# Altium project EDA-02267-V6-0_project.PrjPCB (part 1 of 3)
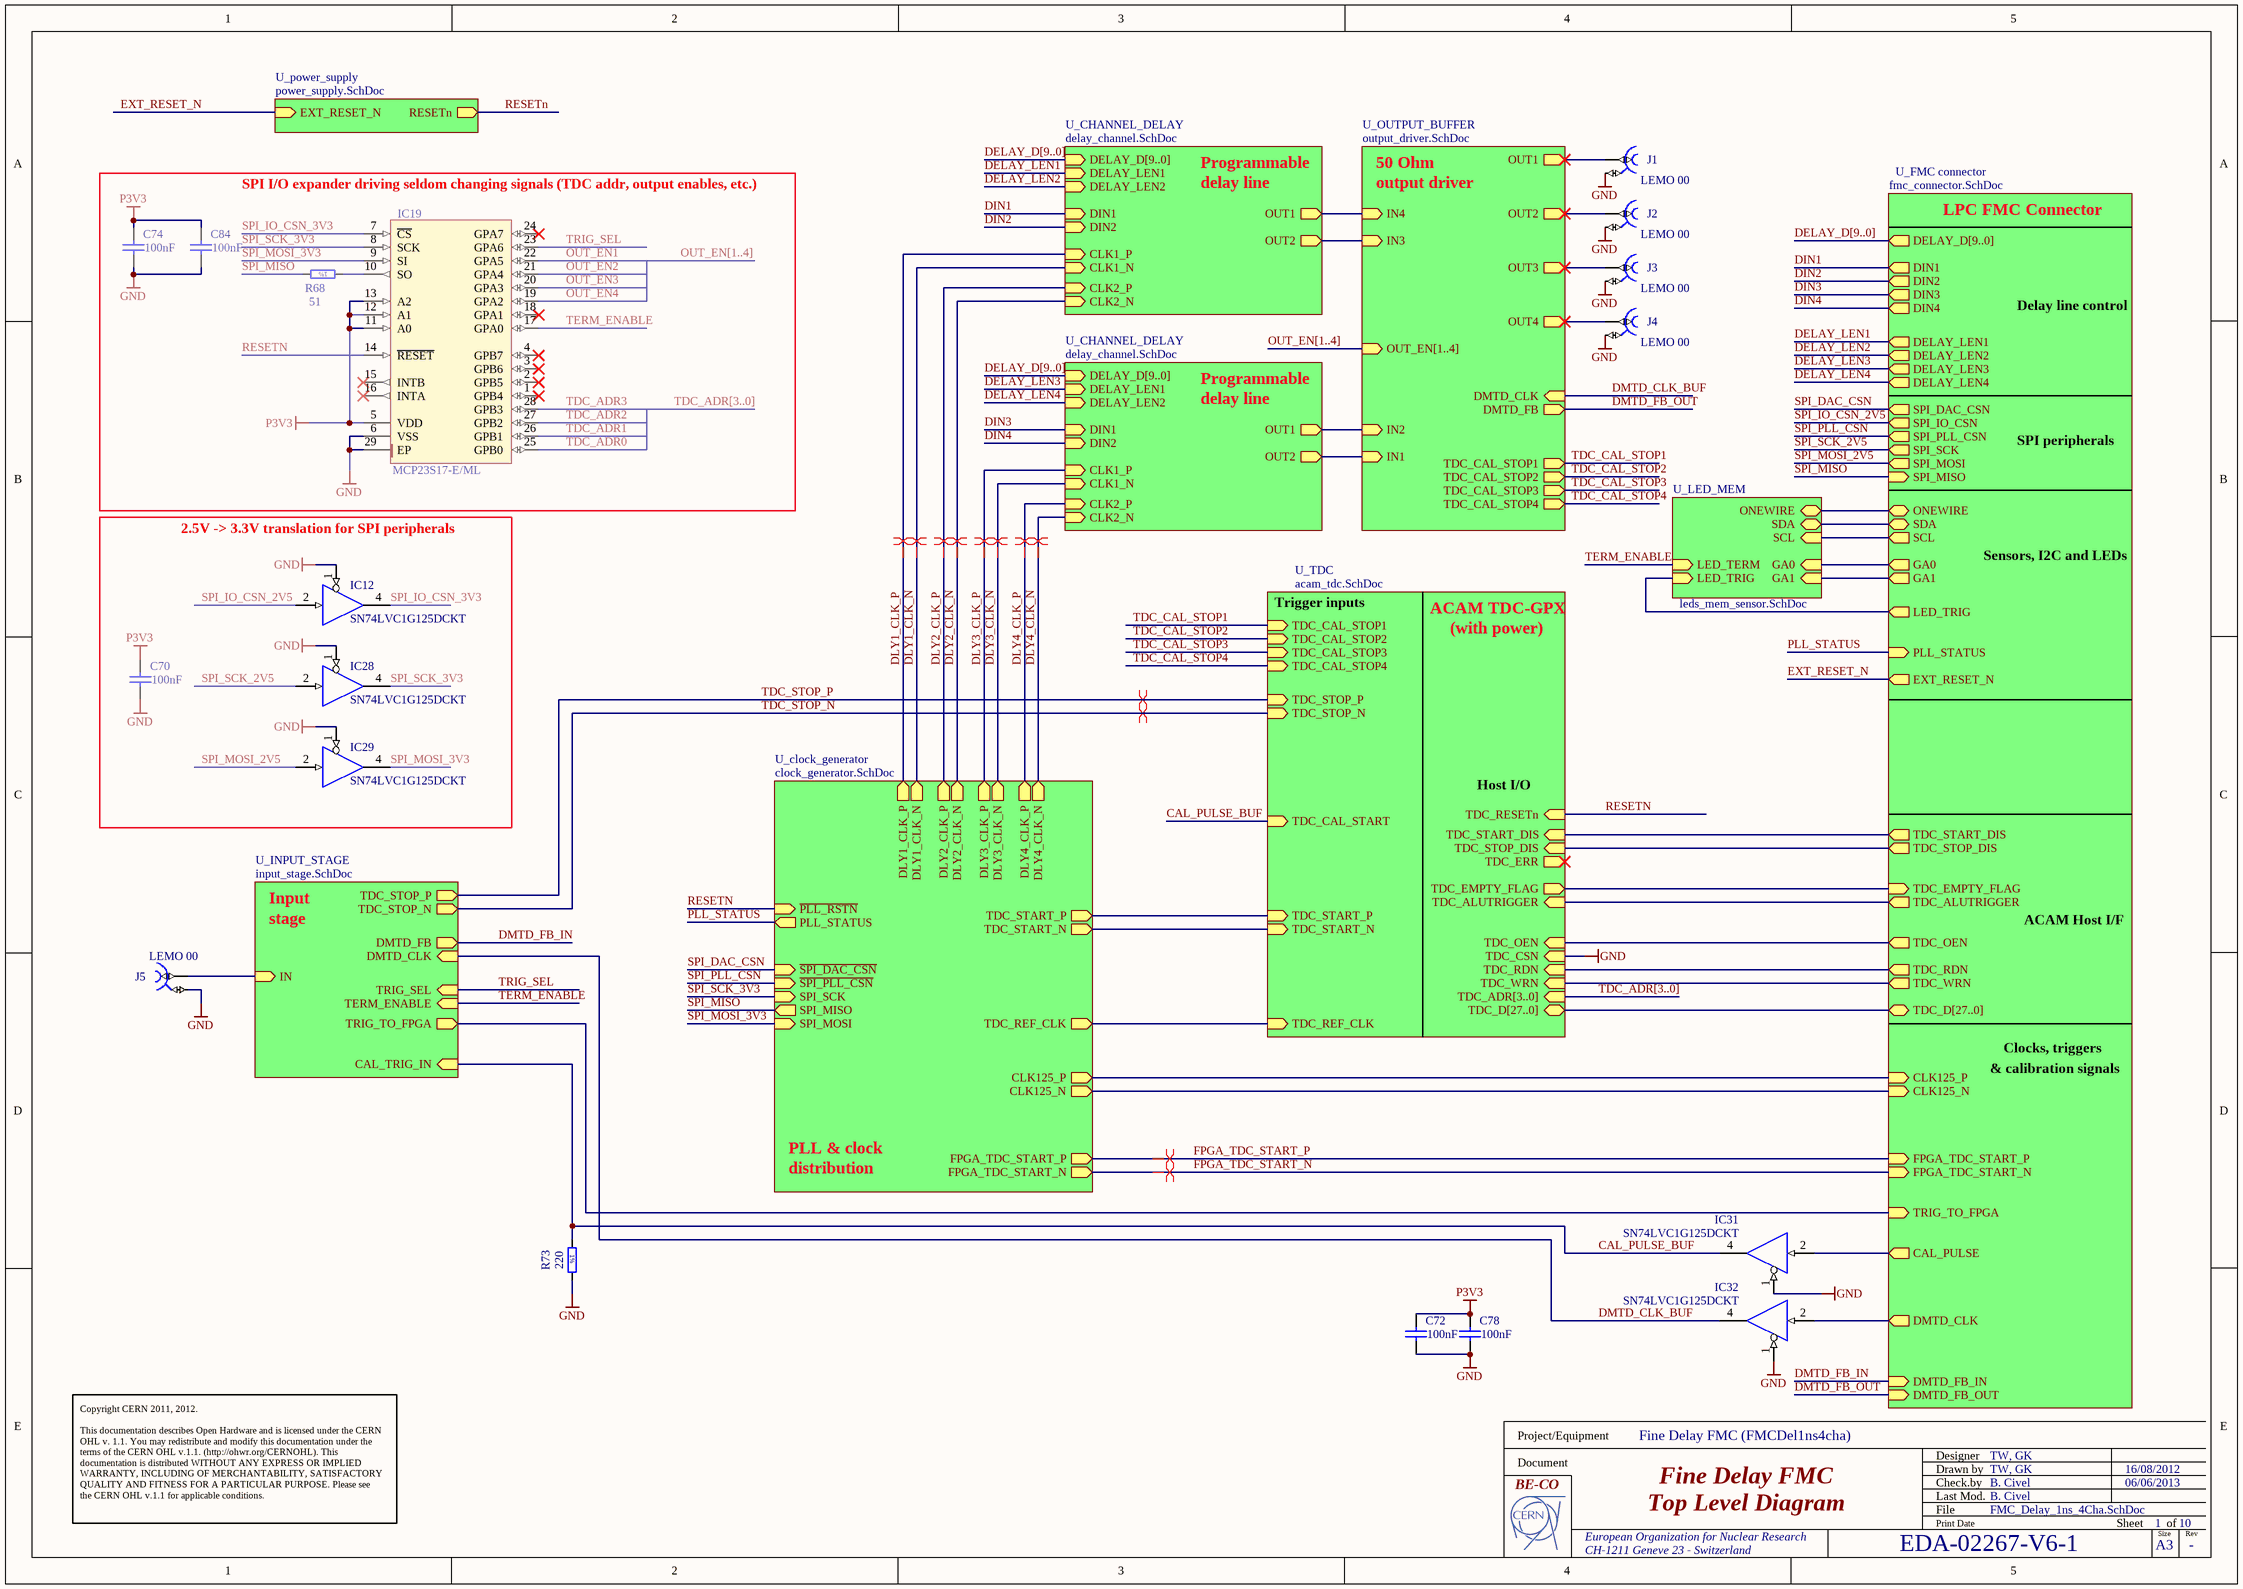
[diagram p0: FMC_Delay_1ns_4Cha.SchDoc]
10 sheets, 354 parts. Net scope: hierarchical (ports join the sheet entries above them; power ports are global).
Board file: EDA-02267-V6-0_pcb.PcbDoc
Sheets:
  FMC_Delay_1ns_4Cha.SchDoc
    U_clock_generator = clock_generator.SchDoc
    U_FMC connector = fmc_connector.SchDoc
    U_power_supply = power_supply.SchDoc
    U_TDC = acam_tdc.SchDoc
    U_CHANNEL_DELAY = delay_channel.SchDoc
    U_CHANNEL_DELAY = delay_channel.SchDoc
    U_OUTPUT_BUFFER = output_driver.SchDoc
      U_drv_single_channel = drv_single_channel.SchDoc
      U_drv_single_channel = drv_single_channel.SchDoc
      U_drv_single_channel = drv_single_channel.SchDoc
      U_drv_single_channel = drv_single_channel.SchDoc
    U_INPUT_STAGE = input_stage.SchDoc
    U_LED_MEM = leds_mem_sensor.SchDoc

## Sheet FMC_Delay_1ns_4Cha.SchDoc: Fine Delay FMC
size 420 x 297 mm; CheckedBy: B. Civel; CompanyName: CERN; DrawnBy: TW, GK; Engineer: TW; Organization: CERN; Address1: European Organization for Nuclear Research; Address2: CH-1211 Geneve 23 - Switzerland; DocumentNumber: 1; Revision: -; SheetNumber: 1; SheetTotal: 10; ModifiedBy: B. Civel; CreateDate: 16/08/2012; CheckedDate: 06/06/2013; EDA_Number: EDA-02267-V6-1; Projet: Fine Delay FMC (FMCDel1ns4cha); Title2: Top Level Diagram; DivGrp: BE-CO; Designer: TW, GK

### Parts
C70  100nF  [CAPC1608X87N]
C72  100nF  [CAPC1608X87N]
C74  100nF  [CAPC1608X87N]
C78  100nF  [CAPC1608X87N]
C84  100nF  [CAPC1608X87N]
IC12  SN74LVC1G125DCKT  [SOT65P210X110-5N]
IC19  MCP23S17-E/ML  [QFN65P600X600X100-29N-S420]
IC28  SN74LVC1G125DCKT  [SOT65P210X110-5N]
IC29  SN74LVC1G125DCKT  [SOT65P210X110-5N]
IC31  SN74LVC1G125DCKT  [SOT65P210X110-5N]
IC32  SN74LVC1G125DCKT  [SOT65P210X110-5N]
J1  LEMO 00  [LEMO_EPK.00.250.NTN]
J2  LEMO 00  [LEMO_EPK.00.250.NTN]
J3  LEMO 00  [LEMO_EPK.00.250.NTN]
J4  LEMO 00  [LEMO_EPK.00.250.NTN]
J5  LEMO 00  [LEMO_EPK.00.250.NTN]
R68  51  [RESC1608X55N]
R73  220  [RESC1608X55N]

### Blocks framed on the sheet
2.5V -> 3.3V translation for SPI peripherals: C70 IC12 IC28 IC29

### Sub-sheets
U_CHANNEL_DELAY = delay_channel.SchDoc: DELAY_D[9..0] (in), DELAY_LEN1 (in), DELAY_LEN2 (in), DIN1 (in), DIN2 (in), OUT1 (out), OUT2 (out), CLK1_P (in), CLK1_N (in), CLK2_N (in), CLK2_P (in)
U_CHANNEL_DELAY = delay_channel.SchDoc: DELAY_D[9..0] (in), DELAY_LEN1 (in), DELAY_LEN2 (in), DIN1 (in), DIN2 (in), OUT1 (out), OUT2 (out), CLK1_P (in), CLK1_N (in), CLK2_N (in), CLK2_P (in)
U_clock_generator = clock_generator.SchDoc: TDC_REF_CLK (out), CLK125_N (out), CLK125_P (out), DLY1_CLK_P (out), DLY1_CLK_N (out), DLY2_CLK_P (out), DLY2_CLK_N (out), DLY3_CLK_P (out), DLY3_CLK_N (out), DLY4_CLK_P (out), DLY4_CLK_N (out), TDC_START_P (out), TDC_START_N (out), FPGA_TDC_START_N (out), FPGA_TDC_START_P (out), PLL_STATUS (out), ~{SPI_PLL_CSN} (in), SPI_SCK (in), SPI_MISO (out), ~{PLL_RSTN} (in), SPI_MOSI (in), ~{SPI_DAC_CSN} (in)
U_FMC connector = fmc_connector.SchDoc: DIN1 (out), DIN2 (out), DIN3 (out), DIN4 (out), TDC_START_DIS (out), TDC_STOP_DIS (out), TDC_EMPTY_FLAG (in), TDC_RDN (out), TDC_WRN (out), TDC_D[27..0] (bidir), DELAY_LEN1 (out), DELAY_LEN2 (out), DELAY_LEN3 (out), DELAY_LEN4 (out), CLK125_P (in), CLK125_N (in), DELAY_D[9..0] (out), SDA (bidir), SCL (out), GA0 (out), GA1 (out), TDC_OEN (out), TDC_ALUTRIGGER (out), FPGA_TDC_START_N (in), FPGA_TDC_START_P (in), ONEWIRE (bidir), LED_TRIG (out), SPI_IO_CSN (out), SPI_MISO (in), SPI_MOSI (out), SPI_PLL_CSN (out), SPI_SCK (out), SPI_DAC_CSN (out), DMTD_CLK (out), DMTD_FB_OUT (in), CAL_PULSE (out), PLL_STATUS (in), TRIG_TO_FPGA (in), DMTD_FB_IN (in), EXT_RESET_N (out)
U_INPUT_STAGE = input_stage.SchDoc: IN (in), TERM_ENABLE (in), TDC_STOP_P (out), TDC_STOP_N (out), TRIG_SEL (in), TRIG_TO_FPGA (out), CAL_TRIG_IN (in), DMTD_FB (out), DMTD_CLK (in)
U_LED_MEM = leds_mem_sensor.SchDoc: SDA (bidir), SCL (in), GA0 (in), GA1 (in), ONEWIRE (bidir), LED_TERM (in), LED_TRIG (in)
U_OUTPUT_BUFFER = output_driver.SchDoc: IN1 (in), IN2 (in), IN3 (in), IN4 (in), OUT1 (out), OUT2 (out), OUT3 (out), OUT4 (out), OUT_EN[1..4] (in), DMTD_FB (out), DMTD_CLK (in), TDC_CAL_STOP1 (out), TDC_CAL_STOP2 (out), TDC_CAL_STOP3 (out), TDC_CAL_STOP4 (out)
U_power_supply = power_supply.SchDoc: RESETn (out), EXT_RESET_N (in)
U_TDC = acam_tdc.SchDoc: TDC_ADR[3..0] (in), TDC_START_P (in), TDC_START_N (in), TDC_START_DIS (in), TDC_STOP_DIS (in), TDC_EMPTY_FLAG (out), TDC_REF_CLK (in), TDC_RESETn (in), TDC_D[27..0] (bidir), TDC_OEN (in), TDC_CSN (in), TDC_RDN (in), TDC_WRN (in), TDC_ERR (out), TDC_STOP_P (in), TDC_STOP_N (in), TDC_ALUTRIGGER (in), TDC_CAL_START (in), TDC_CAL_STOP2 (in), TDC_CAL_STOP3 (in), TDC_CAL_STOP4 (in), TDC_CAL_STOP1 (in)

### Nets
GND: C70.2 C72.2 C74.2 C78.2 C84.2 IC12.1(~{G}) IC12.3(GND) IC19.6(VSS) IC19.29(EP) IC28.1(~{G}) IC28.3(GND) IC29.1(~{G}) IC29.3(GND) IC31.1(~{G}) IC31.3(GND) IC32.1(~{G}) IC32.3(GND) J1.2 J2.2 J3.2 J4.2 J5.2 R73.2 ; sheet U_TDC/TDC_CSN
P3V3: C70.1 C72.1 C74.1 C78.1 C84.1 IC12.5(VCC) IC19.5(VDD) IC19.11(A0) IC19.12(A1) IC19.13(A2) IC28.5(VCC) IC29.5(VCC) IC31.5(VCC) IC32.5(VCC)
CAL_PULSE_BUF: IC31.4(OUT) R73.1 ; sheet U_TDC/TDC_CAL_START, sheet U_INPUT_STAGE/CAL_TRIG_IN
CLK125_N: sheet U_clock_generator/CLK125_N, sheet U_FMC connector/CLK125_N
CLK125_P: sheet U_clock_generator/CLK125_P, sheet U_FMC connector/CLK125_P
DELAY_LEN1: sheet U_FMC connector/DELAY_LEN1, sheet U_CHANNEL_DELAY/DELAY_LEN1
DELAY_LEN2: sheet U_FMC connector/DELAY_LEN2, sheet U_CHANNEL_DELAY/DELAY_LEN2
DELAY_LEN3: sheet U_FMC connector/DELAY_LEN3, sheet U_CHANNEL_DELAY/DELAY_LEN1
DELAY_LEN4: sheet U_FMC connector/DELAY_LEN4, sheet U_CHANNEL_DELAY/DELAY_LEN2
DIN1: sheet U_FMC connector/DIN1, sheet U_CHANNEL_DELAY/DIN1
DIN2: sheet U_FMC connector/DIN2, sheet U_CHANNEL_DELAY/DIN2
DIN3: sheet U_FMC connector/DIN3, sheet U_CHANNEL_DELAY/DIN1
DIN4: sheet U_FMC connector/DIN4, sheet U_CHANNEL_DELAY/DIN2
DLY1_CLK_N: sheet U_clock_generator/DLY1_CLK_N, sheet U_CHANNEL_DELAY/CLK1_N  [project net CLK1_N]
DLY1_CLK_P: sheet U_clock_generator/DLY1_CLK_P, sheet U_CHANNEL_DELAY/CLK1_P  [project net CLK1_P]
DLY2_CLK_N: sheet U_clock_generator/DLY2_CLK_N, sheet U_CHANNEL_DELAY/CLK2_N  [project net CLK2_N]
DLY2_CLK_P: sheet U_clock_generator/DLY2_CLK_P, sheet U_CHANNEL_DELAY/CLK2_P  [project net CLK2_P]
DLY3_CLK_N: sheet U_clock_generator/DLY3_CLK_N, sheet U_CHANNEL_DELAY/CLK1_N  [project net CLK1_N]
DLY3_CLK_P: sheet U_clock_generator/DLY3_CLK_P, sheet U_CHANNEL_DELAY/CLK1_P  [project net CLK1_P]
DLY4_CLK_N: sheet U_clock_generator/DLY4_CLK_N, sheet U_CHANNEL_DELAY/CLK2_N  [project net CLK2_N]
DLY4_CLK_P: sheet U_clock_generator/DLY4_CLK_P, sheet U_CHANNEL_DELAY/CLK2_P  [project net CLK2_P]
DMTD_CLK: IC32.2(IN) ; sheet U_FMC connector/DMTD_CLK
DMTD_CLK_BUF: IC32.4(OUT) ; sheet U_OUTPUT_BUFFER/DMTD_CLK, sheet U_INPUT_STAGE/DMTD_CLK
DMTD_FB_IN: sheet U_FMC connector/DMTD_FB_IN, sheet U_INPUT_STAGE/DMTD_FB
DMTD_FB_OUT: sheet U_FMC connector/DMTD_FB_OUT, sheet U_OUTPUT_BUFFER/DMTD_FB
EXT_RESET_N: sheet U_FMC connector/EXT_RESET_N, sheet U_power_supply/EXT_RESET_N
FPGA_TDC_START_N: sheet U_clock_generator/FPGA_TDC_START_N, sheet U_FMC connector/FPGA_TDC_START_N
FPGA_TDC_START_P: sheet U_clock_generator/FPGA_TDC_START_P, sheet U_FMC connector/FPGA_TDC_START_P
GA0: sheet U_FMC connector/GA0, sheet U_LED_MEM/GA0
GA1: sheet U_FMC connector/GA1, sheet U_LED_MEM/GA1
OUT_EN1: IC19.22(GPA5)
OUT_EN2: IC19.21(GPA4)
OUT_EN3: IC19.20(GPA3)
OUT_EN4: IC19.19(GPA2)
PLL_STATUS: sheet U_clock_generator/PLL_STATUS, sheet U_FMC connector/PLL_STATUS
RESETn: IC19.14(~{RESET}) ; sheet U_clock_generator/~{PLL_RSTN}, sheet U_power_supply/RESETn, sheet U_TDC/TDC_RESETn
SCL: sheet U_FMC connector/SCL, sheet U_LED_MEM/SCL
SDA: sheet U_FMC connector/SDA, sheet U_LED_MEM/SDA
SPI_DAC_CSN: sheet U_clock_generator/~{SPI_DAC_CSN}, sheet U_FMC connector/SPI_DAC_CSN
SPI_IO_CSN_2V5: IC12.2(IN) ; sheet U_FMC connector/SPI_IO_CSN
SPI_IO_CSN_3V3: IC12.4(OUT) IC19.7(~{CS})
SPI_MISO: R68.2 ; sheet U_clock_generator/SPI_MISO, sheet U_FMC connector/SPI_MISO
SPI_MOSI_2V5: IC29.2(IN) ; sheet U_FMC connector/SPI_MOSI
SPI_MOSI_3V3: IC19.9(SI) IC29.4(OUT) ; sheet U_clock_generator/SPI_MOSI
SPI_PLL_CSN: sheet U_clock_generator/~{SPI_PLL_CSN}, sheet U_FMC connector/SPI_PLL_CSN
SPI_SCK_2V5: IC28.2(IN) ; sheet U_FMC connector/SPI_SCK
SPI_SCK_3V3: IC19.8(SCK) IC28.4(OUT) ; sheet U_clock_generator/SPI_SCK
TDC_ADR0: IC19.25(GPB0)
TDC_ADR1: IC19.26(GPB1)
TDC_ADR2: IC19.27(GPB2)
TDC_ADR3: IC19.28(GPB3)
TDC_CAL_STOP1: sheet U_TDC/TDC_CAL_STOP1, sheet U_OUTPUT_BUFFER/TDC_CAL_STOP1
TDC_CAL_STOP2: sheet U_TDC/TDC_CAL_STOP2, sheet U_OUTPUT_BUFFER/TDC_CAL_STOP2
TDC_CAL_STOP3: sheet U_TDC/TDC_CAL_STOP3, sheet U_OUTPUT_BUFFER/TDC_CAL_STOP3
TDC_CAL_STOP4: sheet U_TDC/TDC_CAL_STOP4, sheet U_OUTPUT_BUFFER/TDC_CAL_STOP4
TDC_OEN: sheet U_FMC connector/TDC_OEN, sheet U_TDC/TDC_OEN
TDC_RDN: sheet U_FMC connector/TDC_RDN, sheet U_TDC/TDC_RDN
TDC_START_N: sheet U_clock_generator/TDC_START_N, sheet U_TDC/TDC_START_N
TDC_START_P: sheet U_clock_generator/TDC_START_P, sheet U_TDC/TDC_START_P
TDC_STOP_N: sheet U_TDC/TDC_STOP_N, sheet U_INPUT_STAGE/TDC_STOP_N
TDC_STOP_P: sheet U_TDC/TDC_STOP_P, sheet U_INPUT_STAGE/TDC_STOP_P
TDC_WRN: sheet U_FMC connector/TDC_WRN, sheet U_TDC/TDC_WRN
TERM_ENABLE: IC19.17(GPA0) ; sheet U_INPUT_STAGE/TERM_ENABLE, sheet U_LED_MEM/LED_TERM
TRIG_SEL: IC19.23(GPA6) ; sheet U_INPUT_STAGE/TRIG_SEL
TRIG_TO_FPGA: sheet U_FMC connector/TRIG_TO_FPGA, sheet U_INPUT_STAGE/TRIG_TO_FPGA
NetF5_1: J5.1 ; sheet U_INPUT_STAGE/IN
NetIC1A_6: sheet U_CHANNEL_DELAY/OUT2, sheet U_OUTPUT_BUFFER/IN3
NetIC1A_7: sheet U_CHANNEL_DELAY/OUT1, sheet U_OUTPUT_BUFFER/IN4
NetIC1B_6: sheet U_CHANNEL_DELAY/OUT2, sheet U_OUTPUT_BUFFER/IN1
NetIC1B_7: sheet U_CHANNEL_DELAY/OUT1, sheet U_OUTPUT_BUFFER/IN2
NetIC4_46: sheet U_clock_generator/TDC_REF_CLK, sheet U_TDC/TDC_REF_CLK
NetIC8_4: sheet U_FMC connector/TDC_START_DIS, sheet U_TDC/TDC_START_DIS
NetIC8_5: sheet U_FMC connector/TDC_STOP_DIS, sheet U_TDC/TDC_STOP_DIS
NetIC13_1: sheet U_FMC connector/ONEWIRE, sheet U_LED_MEM/ONEWIRE
NetIC19_10: IC19.10(SO) R68.1
NetIC31_2: IC31.2(IN) ; sheet U_FMC connector/CAL_PULSE
NetJ1_1: J1.1 ; sheet U_OUTPUT_BUFFER/OUT1
NetJ2_1: J2.1 ; sheet U_OUTPUT_BUFFER/OUT2
NetJ3_1: J3.1 ; sheet U_OUTPUT_BUFFER/OUT3
NetJ4_1: J4.1 ; sheet U_OUTPUT_BUFFER/OUT4
NetJ6_g18: sheet U_FMC connector/TDC_ALUTRIGGER, sheet U_TDC/TDC_ALUTRIGGER
NetJ6_g19: sheet U_FMC connector/TDC_EMPTY_FLAG, sheet U_TDC/TDC_EMPTY_FLAG
NetJ6_h19: sheet U_FMC connector/LED_TRIG, sheet U_LED_MEM/LED_TRIG

Not connected (* = marked no-connect by the designer): IC19 1(GPB4)* 2(GPB5)* 3(GPB6)* 4(GPB7)* 15(INTB)* 16(INTA)* 18(GPA1)* 24(GPA7)*

### Buses and harness runs
bus DELAY_D[9..0] = sheet U_CHANNEL_DELAY/DELAY_D[9..0]
bus DELAY_D[9..0] = sheet U_FMC connector/DELAY_D[9..0]
bus OUT_EN[1..4]
bus OUT_EN[1..4] = sheet U_OUTPUT_BUFFER/OUT_EN[1..4]
bus sheet U_FMC connector/TDC_D[27..0] = sheet U_TDC/TDC_D[27..0]
bus TDC_ADR[3..0]
bus TDC_ADR[3..0] = sheet U_TDC/TDC_ADR[3..0]

### Layout directives
differential pair: CLK1_N, CLK1_P, CLK2_N, CLK2_P, FPGA_TDC_START_N, FPGA_TDC_START_P, TDC_STOP_N, TDC_STOP_P

### Notes on the sheet
- SPI I/O expander driving seldom changing signals (TDC addr, output enables, etc.)
- Programmable
- delay line
- 50 Ohm
- output driver
- LPC FMC Connector
- Delay line control
- SPI peripherals
- Sensors, I2C and LEDs
- Trigger inputs
- ACAM TDC-GPX
- (with power)
- Host I/O
- Input
- stage
- ACAM Host I/F
- & calibration signals
- Clocks, triggers
- PLL & clock
- distribution
- Copyright CERN 2011, 2012.
  This documentation describes Open Hardware and is licensed under the CERN OHL v. 1.1. You may redistribute and modify this documentation under the terms of the CERN OHL v.1.1. (http://ohwr.org/CERNOHL). This documentation is distributed WITHOUT ANY EXPRESS OR IMPLIED WARRANTY, INCLUDING OF MERCHANTABILITY, SATISFACTORY QUALITY AND FITNESS FOR A PARTICULAR PURPOSE. Please see the CERN OHL v.1.1 for applicable conditions.
- Project/Equipment
- Document
- Designer
- Drawn by
- Check.by
- File
- Last Mod.
- Print Date
- Sheet
- Size
- A3
- of
- Rev
- (in symbol R0603_51R_1%_0.1W_100PPM) 1%
- (in symbol R0603_220R_1%_0.1W_100PPM) 1%

### Library data of the parts
C70 C72 C74 C78 C84 = CC0603_100NF_50V_10%_X7R: Non-polarised capacitor; Manufacturer1 Part Number: 223858615649; Manufacturer: GENERIC; Part Description: SMD Multilayer Chip Ceramic Capacitor; Table: Capacitors SMD; TC: X7R; Tolerance: ±10%; Voltage: 50V; Author: CERN DEM JLC; Case: 0603; Component Type: Standard; CreateDate: 03/12/2007; HelpURL: \\cern.ch\dfs\Applications\Altium\Datasheets\CC0603_X7R_PHYCOMP.pdf; LatestRevisionDate: 03/12/2007; Manufacturer1 ComponentHeight: 0.87mm; Manufacturer1 Example: PHYCOMP; Manufacturer Part Number: CC0603_100NF_50V_10%_X7R; Mounted: Yes; Pin Count: 2; SMD: Yes; Socket: No; Status: Preferred; Value: 100nF; Part Number: CC0603_100NF_50V_10%_X7R; Component Kind: Standard
IC12 IC28 IC29 IC31 IC32 = SN74LVC1G125DCKT: Single Bus Buffer Gate With 3-State Output; Manufacturer: TEXAS INSTRUMENTS; Table: Standard Logic; PressFit: No; Bonding: No; Part Number: SN74LVC1G125DCKT; Component Kind: Standard; Component Type: Standard; Device: SN74LVC1G125DCKT; PackageDescription: SOT353, SC70-5, SOT, 0.65mm Pitch, 5 pin, 1.25mm W X 2.00mm L X 1.10mm H, IPC Medium Density; Part Description: Single Bus Buffer Gate With 3-State Output; Manufacturer Part Number: SN74LVC1G125DCKT; Pin Count: 5; Case: SOT353; Mounted: Yes; Socket: No; SMD: Yes; ComponentHeight: 1.1mm; Author: CERN DEM JLC; HelpURL: \\cern.ch\dfs\Applications\Altium\Datasheets\SN74LVC1G125DCKT.pdf; CreateDate: 19/12/2011; LatestRevisionDate: 19/12/2011
IC19 = MCP23S17-E/ML: 16-bit I/O Port Expander With Serial Interface; Manufacturer: MICROCHIP TECHNOLOGY; Table: Analog & Interface; PressFit: No; Bonding: No; Part Number: MCP23S17-E/ML; Component Kind: Standard; Component Type: Standard; Device: MCP23S17-E/ML; PackageDescription: QFN, 0.65mm pitch, square; 28 pin, 6.00mm L X 6.00mm W X 1.00mm H body (w/thermal tab 4.2mm x 4.2mm), IPC Medium Density; Part Description: 16-bit I/O Port Expander With Serial Interface; Manufacturer Part Number: MCP23S17-E/ML; Pin Count: 29; Case: QFN28; Mounted: Yes; Socket: No; SMD: Yes; ComponentHeight: 1mm; Author: CERN DEM JLC; HelpURL: \\cern.ch\dfs\Applications\Altium\Datasheets\MCP23S17-E-ML.pdf; CreateDate: 11/05/2010; LatestRevisionDate: 11/05/2010
J1-J5 = LEMO_EPK.00.250.NTN: Part Description: Size 00, 50 Ohms Coaxial Elbow (90°) socket With Clearance Under The Body; SCEM: 09.46.11.180.6; PressFit: No; Part Number: LEMO_EPK.00.250.NTN; Component Kind: Standard; Component Type: Standard; Pin Count: 2; Family: LEMO 00; Mounted: Yes; Socket: No; SMD: No; Status: None; Manufacturer: LEMO; Manufacturer Part Number: EPK.00.250.NTN; ComponentHeight: 7mm; HelpURL: \\cern.ch\dfs\Applications\Altium\Datasheets\LEMO_EPK.00.250.NTN.pdf; Author: CERN DEM JLC; CreateDate: 04/09/2012; LatestRevisionDate: 04/09/2012; Table: LEMO
R68 = R0603_51R_1%_0.1W_100PPM: Resistor - 1%; Part Description: General Purpose Thick Film Chip Resistor; Manufacturer: GENERIC; Manufacturer1 Part Number: NRC06F51R0TRF; Power: 0.1W; TC: ±100ppm/°C; Table: Resistors SMD; Part Number: R0603_51R_1%_0.1W_100PPM; Component Kind: Standard; Component Type: Standard; Pin Count: 2; Value: 51; Status: Preferred; Tolerance: ±1%; Manufacturer Part Number: R0603_51R_1%_0.1W_100PPM; Case: 0603; Mounted: Yes; Socket: No; SMD: Yes; Manufacturer1 Example: NIC COMPONENT; Manufacturer1 ComponentHeight: 0.55mm; HelpURL: \\cern.ch\dfs\Applications\Altium\Datasheets\R0603_NIC_NRC.pdf; Author: CERN DEM JLC; CreateDate: 12/3/2007; LatestRevisionDate: 3/13/2008
R73 = R0603_220R_1%_0.1W_100PPM: Resistor - 1%; Part Description: General Purpose Thick Film Chip Resistor; Manufacturer: GENERIC; Manufacturer1 Part Number: NRC06F2200TRF; Power: 0.1W; TC: ±100ppm/°C; Table: Resistors SMD; Part Number: R0603_220R_1%_0.1W_100PPM; Component Kind: Standard; Component Type: Standard; Pin Count: 2; Value: 220; Status: Preferred; Tolerance: ±1%; Manufacturer Part Number: R0603_220R_1%_0.1W_100PPM; Case: 0603; Mounted: Yes; Socket: No; SMD: Yes; Manufacturer1 Example: NIC COMPONENT; Manufacturer1 ComponentHeight: 0.55mm; HelpURL: \\cern.ch\dfs\Applications\Altium\Datasheets\R0603_NIC_NRC.pdf; Author: CERN DEM JLC; CreateDate: 12/3/2007; LatestRevisionDate: 3/13/2008

## Sheet clock_generator.SchDoc: Fine Delay FMC
size 297 x 209 mm; CheckedBy: B. Civel; Author: TW; CompanyName: CERN; DrawnBy: TW, GK; Engineer: TW; Organization: CERN; Address1: European Organization for Nuclear Research; Address2: CH-1211 Geneve 23 - Switzerland; DocumentNumber: 2; Revision: -; SheetNumber: 2; SheetTotal: 10; ModifiedBy: B. Civel; CreateDate: 16/08/2012; CheckedDate: 06/06/2013; Title2: PLL & clock distribution; EDA_Number: EDA-02267-V6-1; Projet: Fine Delay FMC (FMCDel1ns4cha); DivGrp: BE-CO; Designer: TW, GK; ModifiedDate: 16/08/2012
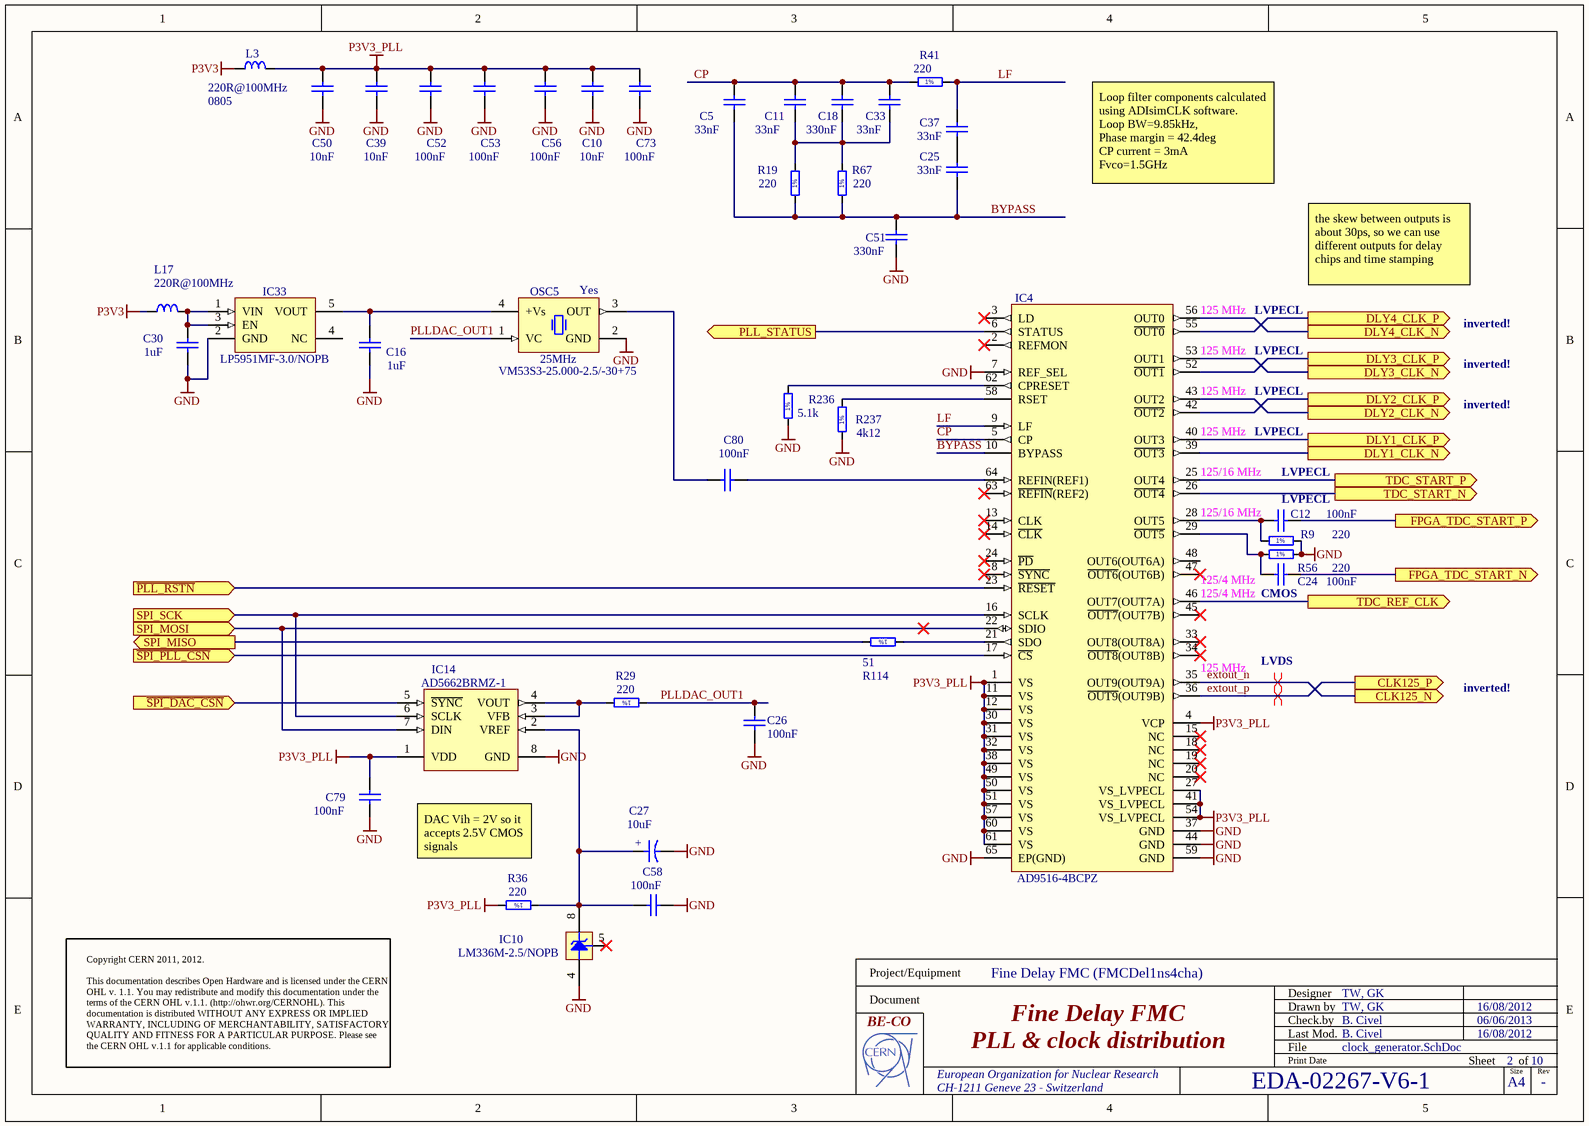
[diagram p1: clock_generator.SchDoc]

### Parts
C5  33nF  [CAPC1608X87N]
C10  10nF  [CAPC1608X87N]
C11  33nF  [CAPC1608X87N]
C12  100nF  [CAPC1608X87N]
C16  1uF  [CAPC2012X140N]
C18  330nF  [CAPC1608X87N]
C24  100nF  [CAPC1608X87N]
C25  33nF  [CAPC1608X87N]
C26  100nF  [CAPC1608X87N]
C27  10uF  [CAPMP3528X210N]
C30  1uF  [CAPC2012X140N]
C33  33nF  [CAPC1608X87N]
C37  33nF  [CAPC1608X87N]
C39  10nF  [CAPC1608X87N]
C50  10nF  [CAPC1608X87N]
C51  330nF  [CAPC1608X87N]
C52  100nF  [CAPC1608X87N]
C53  100nF  [CAPC1608X87N]
C56  100nF  [CAPC1608X87N]
C58  100nF  [CAPC1608X87N]
C73  100nF  [CAPC1608X87N]
C79  100nF  [CAPC1608X87N]
C80  100nF  [CAPC1608X87N]
IC4  AD9516-4BCPZ  [QFN50P900X900X100-65N-S635]
IC10  LM336M-2.5/NOPB  [SOIC127P600X175-8N]
IC14  AD5662BRMZ-1  [SOP65P490X110-8N]
IC33  LP5951MF-3.0/NOPB  [SOT95P284X122-5N]
L3  220R@100MHz  Case: 0805  [INDC2012X105N]
L17  220R@100MHz  [INDC2012X105N]
OSC5  25MHz  Manufacturer Part Number: VM53S3-25.000-2.5/-30+75  Mounted: Yes  [OSCCC320X500X160-4N]
R9  220  [RESC1608X55N]
R19  220  [RESC1608X55N]
R29  220  [RESC1608X55N]
R36  220  [RESC1608X55N]
R41  220  [RESC1608X55N]
R56  220  [RESC1608X55N]
R67  220  [RESC1608X55N]
R114  51  [RESC1608X55N]
R236  5.1k  [RESC1608X55N]
R237  4k12  [RESC1608X55N]

### Ports
CLK125_N (out), CLK125_P (out), DLY1_CLK_N (out), DLY1_CLK_P (out), DLY2_CLK_N (out), DLY2_CLK_P (out), DLY3_CLK_N (out), DLY3_CLK_P (out), DLY4_CLK_N (out), DLY4_CLK_P (out), FPGA_TDC_START_N (out), FPGA_TDC_START_P (out), PLL_STATUS (out), SPI_MISO (out), SPI_MOSI (in), SPI_SCK (in), TDC_REF_CLK (out), TDC_START_N (out), TDC_START_P (out), ~{PLL_RSTN} (in), ~{SPI_DAC_CSN} (in), ~{SPI_PLL_CSN} (in)

### Nets
GND: C10.2 C16.2 C26.2 C27.2 C30.2 C39.2 C50.2 C51.1 C52.1 C53.1 C56.1 C58.1 C73.1 C79.1 IC4.7(REF_SEL) IC4.37(GND) IC4.44(GND) IC4.59(GND) IC4.65(EP(GND)) IC10.4(A) IC14.8(GND) IC33.2(GND) OSC5.2(GND) R9.2 R56.2 R236.1 R237.1
P3V3: L3.1 L17.1
P3V3_PLL: C10.1 C39.1 C50.1 C52.2 C53.2 C56.2 C73.2 C79.2 IC4.1(VS) IC4.4(VCP) IC4.11(VS) IC4.12(VS) IC4.27(VS_LVPECL) IC4.30(VS) IC4.31(VS) IC4.32(VS) IC4.38(VS) IC4.41(VS_LVPECL) IC4.49(VS) IC4.50(VS) IC4.51(VS) IC4.54(VS_LVPECL) IC4.57(VS) IC4.60(VS) IC4.61(VS) IC14.1(VDD) L3.2 R36.2
BYPASS: C5.1 C25.1 C51.2 IC4.10(BYPASS) R19.1 R67.1
CLK1_N: IC4.39(~{OUT3}) ; port DLY1_CLK_N
CLK1_N: IC4.53(OUT1) ; port DLY3_CLK_N  [a separate net that carries the same name]
CLK1_P: IC4.40(OUT3) ; port DLY1_CLK_P
CLK1_P: IC4.52(~{OUT1}) ; port DLY3_CLK_P  [a separate net that carries the same name]
CLK2_N: IC4.43(OUT2) ; port DLY2_CLK_N
CLK2_N: IC4.56(OUT0) ; port DLY4_CLK_N  [a separate net that carries the same name]
CLK2_P: IC4.42(~{OUT2}) ; port DLY2_CLK_P
CLK2_P: IC4.55(~{OUT0}) ; port DLY4_CLK_P  [a separate net that carries the same name]
CP: C5.2 C11.2 C18.2 C33.2 IC4.5(CP) R41.1
extout_n: IC4.35(OUT9(OUT9A)) ; port CLK125_N  [project net CLK125_N]
extout_p: IC4.36(~{OUT9}(OUT9B)) ; port CLK125_P  [project net CLK125_P]
FPGA_TDC_START_N: C24.1 ; port FPGA_TDC_START_N
FPGA_TDC_START_P: C12.1 ; port FPGA_TDC_START_P
LF: C37.2 IC4.9(LF) R41.2
PLL_STATUS: IC4.6(STATUS) ; port PLL_STATUS
PLLDAC_OUT1: C26.1 OSC5.1(VC) R29.1
RESETn: IC4.23(~{RESET}) ; port ~{PLL_RSTN}
SPI_DAC_CSN: IC14.5(~{SYNC}) ; port ~{SPI_DAC_CSN}
SPI_MISO: R114.2 ; port SPI_MISO
SPI_MOSI_3V3: IC4.22(SDIO) IC14.7(DIN) ; port SPI_MOSI
SPI_PLL_CSN: IC4.17(~{CS}) ; port ~{SPI_PLL_CSN}
SPI_SCK_3V3: IC4.16(SCLK) IC14.6(SCLK) ; port SPI_SCK
TDC_START_N: IC4.26(~{OUT4}) ; port TDC_START_N
TDC_START_P: IC4.25(OUT4) ; port TDC_START_P
NetC11_1: C11.1 C18.1 C33.1 R19.2 R67.2
NetC12_2: C12.2 IC4.28(OUT5) R9.1
NetC16_1: C16.1 IC33.5(VOUT) OSC5.4(+Vs)
NetC24_2: C24.2 IC4.29(~{OUT5}) R56.1
NetC25_2: C25.2 C37.1
NetC27_1: C27.1 C58.2 IC10.8(C) IC14.2(VREF) R36.1
NetC30_1: C30.1 IC33.1(VIN) IC33.3(EN) L17.2
NetC80_1: C80.1 IC4.64(REFIN(REF1))
NetC80_2: C80.2 OSC5.3(OUT)
NetIC4_21: IC4.21(SDO) R114.1
NetIC4_46: IC4.46(OUT7(OUT7A)) ; port TDC_REF_CLK
NetIC4_58: IC4.58(RSET) R237.2
NetIC4_62: IC4.62(CPRESET) R236.2
NetIC14_3: IC14.3(VFB) IC14.4(VOUT) R29.2

Not connected (* = marked no-connect by the designer): IC4 2(REFMON)* 3(LD)* 8(~{SYNC})* 13(CLK)* 14(~{CLK})* 15(NC)* 18(NC)* 19(NC)* 20(NC)* 24(~{PD})* 33(OUT8(OUT8A))* 34(~{OUT8}(OUT8B))* 45(~{OUT7}(OUT7B))* 47(~{OUT6}(OUT6B))* 48(OUT6(OUT6A)) 63(~{REFIN}(REF2))*; IC10 5(Adj)*; IC33 4(NC)

### Layout directives
differential pair: CLK125_N, CLK125_P

### Notes on the sheet
- Loop filter components calculated using ADIsimCLK software.
  Loop BW=9.85kHz,
  Phase margin = 42.4deg
  CP current = 3mA
  Fvco=1.5GHz
- (near IC4) 125 MHz
- LVPECL
- the skew between outputs is about 30ps, so we can use different outputs for delay chips and time stamping
- inverted!
- 125/16 MHz
- (near C12) LVPECL
- 125/4 MHz
- (near C24) CMOS
- LVDS
- DAC Vih = 2V so it accepts 2.5V CMOS signals
- Copyright CERN 2011, 2012.
  This documentation describes Open Hardware and is licensed under the CERN OHL v. 1.1. You may redistribute and modify this documentation under the terms of the CERN OHL v.1.1. (http://ohwr.org/CERNOHL). This documentation is distributed WITHOUT ANY EXPRESS OR IMPLIED WARRANTY, INCLUDING OF MERCHANTABILITY, SATISFACTORY QUALITY AND FITNESS FOR A PARTICULAR PURPOSE. Please see the CERN OHL v.1.1 for applicable conditions.
- Project/Equipment
- Document
- Designer
- Drawn by
- Check.by
- File
- Last Mod.
- Print Date
- Sheet
- Size
- A4
- of
- Rev
- (in symbol CTE3528-21_10UF_16V_20%_SANYO_TQC) +
- (in symbol R0603_4K12_1%_0.1W_100PPM) 1%
- (in symbol R0603_5K1_1%_0.1W_100PPM) 1%
- (in symbol R0603_51R_1%_0.1W_100PPM) 1%
- (in symbol R0603_220R_1%_0.1W_100PPM) 1%

### Library data of the parts
C5 C11 C25 C33 C37 = CC0603_33NF_25V_10%_X7R: Non-polarised capacitor; Part Description: SMD Multilayer Chip Ceramic Capacitor; Manufacturer: GENERIC; Manufacturer1 Part Number: 223891615643; Voltage: 25V; TC: X7R; Tolerance: ±10%; Table: Capacitors SMD; Part Number: CC0603_33NF_25V_10%_X7R; Component Kind: Standard; Component Type: Standard; Pin Count: 2; Value: 33nF; Status: Preferred; Manufacturer Part Number: CC0603_33NF_25V_10%_X7R; Case: 0603; Mounted: Yes; Socket: No; SMD: Yes; Manufacturer1 Example: PHYCOMP; Manufacturer1 ComponentHeight: 0.87mm; HelpURL: \\cern.ch\dfs\Applications\Altium\Datasheets\CC0603_X7R_PHYCOMP.pdf; Author: CERN DEM JLC; CreateDate: 03/12/2007; LatestRevisionDate: 03/12/2007
C10 C39 C50 = CC0603_10NF_50V_10%_X7R: Non-polarised capacitor; Part Description: SMD Multilayer Chip Ceramic Capacitor; Manufacturer: GENERIC; Manufacturer1 Part Number: 223858615636; Voltage: 50V; TC: X7R; Tolerance: ±10%; Table: Capacitors SMD; Part Number: CC0603_10NF_50V_10%_X7R; Component Kind: Standard; Component Type: Standard; Pin Count: 2; Value: 10nF; Status: Preferred; Manufacturer Part Number: CC0603_10NF_50V_10%_X7R; Case: 0603; Mounted: Yes; Socket: No; SMD: Yes; Manufacturer1 Example: PHYCOMP; Manufacturer1 ComponentHeight: 0.87mm; HelpURL: \\cern.ch\dfs\Applications\Altium\Datasheets\CC0603_X7R_PHYCOMP.pdf; Author: CERN DEM JLC; CreateDate: 03/12/2007; LatestRevisionDate: 03/12/2007
C12 C24 C26 C52 C53 C56 C58 C73 = CC0603_100NF_50V_10%_X7R: Non-polarised capacitor; Part Description: SMD Multilayer Chip Ceramic Capacitor; Manufacturer: GENERIC; Manufacturer1 Part Number: 223858615649; Voltage: 50V; TC: X7R; Tolerance: ±10%; Table: Capacitors SMD; Part Number: CC0603_100NF_50V_10%_X7R; Component Kind: Standard; Component Type: Standard; Pin Count: 2; Value: 100nF; Status: Preferred; Manufacturer Part Number: CC0603_100NF_50V_10%_X7R; Case: 0603; Mounted: Yes; Socket: No; SMD: Yes; Manufacturer1 Example: PHYCOMP; Manufacturer1 ComponentHeight: 0.87mm; HelpURL: \\cern.ch\dfs\Applications\Altium\Datasheets\CC0603_X7R_PHYCOMP.pdf; Author: CERN DEM JLC; CreateDate: 03/12/2007; LatestRevisionDate: 03/12/2007
C16 C30 = CC0805_1UF_35V_20%_X7R: Non-polarised capacitor; Part Description: SMD Multilayer Chip Ceramic Capacitor; Manufacturer: GENERIC; Manufacturer1 Part Number: GMK212B7105MG-T; Voltage: 35V; TC: X7R; Tolerance: ±20%; Table: Capacitors SMD; Part Number: CC0805_1UF_35V_20%_X7R; Component Kind: Standard; Component Type: Standard; Pin Count: 2; Value: 1uF; Status: Not Recommended; Manufacturer Part Number: CC0805_1UF_35V_20%_X7R; Case: 0805; Mounted: Yes; Socket: No; SMD: Yes; Manufacturer1 Example: TAIYO YUDEN; Manufacturer1 ComponentHeight: 1.35mm; HelpURL: \\cern.ch\dfs\Applications\Altium\Datasheets\CC0805_X7R_TAIYO-YUDEN_HIGH-VALUE.pdf; Author: CERN DEM JLC; CreateDate: 22/06/2011; LatestRevisionDate: 22/06/2011
C18 C51 = CC0603_330NF_16V_10%_X5R: Non-polarised capacitor; Part Description: SMD Multilayer Chip Ceramic Capacitor; Manufacturer: GENERIC; Manufacturer1 Part Number: 223878613656; Voltage: 16V; TC: X5R; Tolerance: ±10%; Table: Capacitors SMD; Part Number: CC0603_330NF_16V_10%_X5R; Component Kind: Standard; Component Type: Standard; Pin Count: 2; Value: 330nF; Status: Preferred; Manufacturer Part Number: CC0603_330NF_16V_10%_X5R; Case: 0603; Mounted: Yes; Socket: No; SMD: Yes; Manufacturer1 Example: PHYCOMP; Manufacturer1 ComponentHeight: 0.87mm; HelpURL: \\cern.ch\dfs\Applications\Altium\Datasheets\CC0805_X5R_PHYCOMP_HC.pdf; Author: CERN DEM JLC; CreateDate: 03/12/2007; LatestRevisionDate: 03/12/2007
C27 = CTE3528-21_10UF_16V_20%_SANYO_TQC: Polarised capacitor; Part Description: ESR 0R1 Solid Tantalum Chip Capacitor; Manufacturer: SANYO; Manufacturer Part Number: 16TQC10M; Voltage: 16V; Tolerance: ±20%; Table: Capacitors SMD; Part Number: CTE3528-21_10UF_16V_20%_SANYO_TQC; Component Kind: Standard; Component Type: Standard; Pin Count: 2; Value: 10uF; Status: Obsolete; Case: B; Mounted: Yes; Socket: No; SMD: Yes; ComponentHeight: 2.1mm; HelpURL: \\cern.ch\dfs\Applications\Altium\Datasheets\CTE_SANYO_TQC.pdf; Author: CERN DEM JLC; CreateDate: 29/06/2011; LatestRevisionDate: 01/09/2014
C79 C80 = CC0603_100NF_50V_10%_X7R: as C70 on sheet FMC_Delay_1ns_4Cha; Author: CERN DEM JLC; Case: 0603; Component Type: Standard; CreateDate: 03/12/2007; HelpURL: \\cern.ch\dfs\Applications\Altium\Datasheets\CC0603_X7R_PHYCOMP.pdf; LatestRevisionDate: 03/12/2007; Manufacturer1 ComponentHeight: 0.87mm; Manufacturer1 Example: PHYCOMP; Manufacturer Part Number: CC0603_100NF_50V_10%_X7R; Mounted: Yes; Pin Count: 2; SMD: Yes; Socket: No; Status: Preferred; Value: 100nF; Part Number: CC0603_100NF_50V_10%_X7R; Component Kind: Standard
IC4 = AD9516-4BCPZ: 14-Output Clock Generator with Integrated 1.6 GHz VCO; Manufacturer: ANALOG DEVICES; Table: Logic; PressFit: No; Bonding: No; Part Number: AD9516-4BCPZ; Component Kind: Standard; Component Type: Standard; Device: AD9516-4BCPZ; PackageDescription: QFN,0.50mm pitch,square;64 pin,9.00mm L X 9.00mm W X 1.00mm H body (6.35mm X 6.35mm thermal tab), IPC Medium Density; Part Description: 14-Output Clock Generator with Integrated 1.6 GHz VCO; Manufacturer Part Number: AD9516-4BCPZ; Pin Count: 65; Case: QFN64; Mounted: Yes; Socket: No; SMD: Yes; ComponentHeight: 1.0mm; HelpURL: \\cern.ch\dfs\Applications\Altium\Datasheets\AD9516-4BCPZ.pdf; Author: CERN DEM JLC; CreateDate: 18/01/2010; LatestRevisionDate: 18/01/2010
IC10 = LM336M-2.5/NOPB: Reference Diode; Part Description: 2.5V Voltage Reference Diode; Manufacturer: TEXAS INSTRUMENTS; Table: Regulators; PressFit: No; Bonding: No; Part Number: LM336M-2.5/NOPB; Component Kind: Standard; Component Type: Standard; Device: LM336M-2.5/NOPB; PackageDescription: SOIC 8, Pitch 1.27mm - Body 4x5mm, IPC Medium Density; Manufacturer Part Number: LM336M-2.5/NOPB; Pin Count: 3; Case: SOIC8; Mounted: Yes; Socket: No; SMD: Yes; ComponentHeight: 1.75mm; HelpURL: \\cern.ch\dfs\Applications\Altium\Datasheets\LM336M-2.5-NOPB.pdf; Author: CERN DEM JLC; CreateDate: 12/04/2010; LatestRevisionDate: 16/09/2014
IC14 = AD5662BRMZ-1: 2.7V to 5.5V, 250uA, Rail-to-Rail Output 16-Bit nanoDAC; Manufacturer: ANALOG DEVICES; Table: Analog & Interface; PressFit: No; Bonding: No; Part Number: AD5662BRMZ-1; Component Kind: Standard; Component Type: Standard; Device: AD5662BRMZ-1; PackageDescription: SOP, 8-Leads, Body 3.0x3.0mm, Pitch 0.65mm, IPC Medium Density; Part Description: 2.7V to 5.5V, 250uA, Rail-to-Rail Output 16-Bit nanoDAC; Manufacturer Part Number: AD5662BRMZ-1; Pin Count: 8; Case: MSOP8; Mounted: Yes; Socket: No; SMD: Yes; ComponentHeight: 1.1mm; Author: CERN DEM JLC; HelpURL: \\cern.ch\dfs\Applications\Altium\Datasheets\AD5662BRMZ-1.pdf; CreateDate: 10/01/2011; LatestRevisionDate: 10/01/2011
IC33 = LP5951MF-3.0/NOPB: 150mA Micropower Low-Dropout CMOS Voltage Regulator; Part Description: 3V,  150mA Micropower Low-Dropout CMOS Voltage Regulator; Manufacturer: TEXAS INSTRUMENTS; Table: Regulators; PressFit: No; Bonding: No; Part Number: LP5951MF-3.0/NOPB; Component Kind: Standard; Component Type: Standard; Device: LP5951MF-3.0/NOPB; PackageDescription: SOT23 5, Pitch 0.95mm - Body 1.67x2.99mm, IPC Medium Density; Manufacturer Part Number: LP5951MF-3.0/NOPB; Pin Count: 5; Case: SOT23-5; Mounted: Yes; Socket: No; SMD: Yes; ComponentHeight: 1.19mm; HelpURL: \\cern.ch\dfs\Applications\Altium\Datasheets\LP5951MF-3.0-NOPB.pdf; Author: CERN DEM JLC; CreateDate: 24/01/2011; LatestRevisionDate: 16/09/2014
L3 L17 = IND0805_MURATA_BLM21PG221SN1D: Inductor; Part Description: SMD EMIFIL Suppression Chip Ferrite Bead; Manufacturer: MURATA; Power: 2A; Resistance: 0.05R; Tolerance: ±25%; Table: Inductors SMD; Part Number: IND0805_MURATA_BLM21PG221SN1D; Component Kind: Standard; Component Type: Standard; Pin Count: 2; Value: 220R@100MHz; Status: None; Manufacturer Part Number: BLM21PG221SN1D; Mounted: Yes; Socket: No; SMD: Yes; ComponentHeight: 1.05mm; HelpURL: \\cern.ch\dfs\Applications\Altium\Datasheets\IND0402_MURATA_BLM21P.pdf; Author: CERN DEM JLC; CreateDate: 25/01/2010; LatestRevisionDate: 25/01/2010
  L17: Case: 0805
OSC5 = OSC_25MHZ_MERCURY_VM53S3-25.000-2.5/-30+75: Oscillator 4 pins 1=VC 2=GND 3=OUT 4=+Vs; Part Description: 3V ±2.5ppmVoltage Controlled Temperature Compensated Crystal Oscillator VM53S3 Series; Manufacturer: MERCURY ELECTRONICS; Table: Crystals & Oscillators; PressFit: No; Bonding: No; Part Number: OSC_25MHZ_MERCURY_VM53S3-25.000-2.5/-30+75; Component Kind: Standard; Component Type: Standard; PackageDescription: SMD Oscillator, Corner Convave, 4 pins, 5x3.2mm; Value: 25MHz; Pin Count: 4; Socket: No; SMD: Yes; ComponentHeight: 1.6mm; HelpURL: \\cern.ch\dfs\Applications\Altium\Datasheets\OSC_MERCURY_VM53S3.pdf; Author: CERN DEM JLC; CreateDate: 20/01/2010; LatestRevisionDate: 24/01/2011
R9 R19 R29 R36 R41 R56 R67 = R0603_220R_1%_0.1W_100PPM: as R73 on sheet FMC_Delay_1ns_4Cha; Part Number: R0603_220R_1%_0.1W_100PPM; Component Kind: Standard; Component Type: Standard; Pin Count: 2; Value: 220; Status: Preferred; Tolerance: ±1%; Manufacturer Part Number: R0603_220R_1%_0.1W_100PPM; Case: 0603; Mounted: Yes; Socket: No; SMD: Yes; Manufacturer1 Example: NIC COMPONENT; Manufacturer1 ComponentHeight: 0.55mm; HelpURL: \\cern.ch\dfs\Applications\Altium\Datasheets\R0603_NIC_NRC.pdf; Author: CERN DEM JLC; CreateDate: 12/3/2007; LatestRevisionDate: 3/13/2008
R114 = R0603_51R_1%_0.1W_100PPM: as R68 on sheet FMC_Delay_1ns_4Cha; Part Number: R0603_51R_1%_0.1W_100PPM; Component Kind: Standard; Component Type: Standard; Pin Count: 2; Value: 51; Status: Preferred; Tolerance: ±1%; Manufacturer Part Number: R0603_51R_1%_0.1W_100PPM; Case: 0603; Mounted: Yes; Socket: No; SMD: Yes; Manufacturer1 Example: NIC COMPONENT; Manufacturer1 ComponentHeight: 0.55mm; HelpURL: \\cern.ch\dfs\Applications\Altium\Datasheets\R0603_NIC_NRC.pdf; Author: CERN DEM JLC; CreateDate: 12/3/2007; LatestRevisionDate: 3/13/2008
R236 = R0603_5K1_1%_0.1W_100PPM: Resistor - 1%; Part Description: General Purpose Thick Film Chip Resistor; Manufacturer: GENERIC; Manufacturer1 Part Number: NRC06F5101TRF; Value: 5k1; Power: 0.1W; TC: ±100ppm/°C; Table: Resistors SMD; Part Number: R0603_5K1_1%_0.1W_100PPM; Component Kind: Standard; Component Type: Standard; Designator: Resistor - 1%; Library Reference: Resistor - 1%; Pin Count: 2; Status: Preferred; Tolerance: ±1%; Manufacturer Part Number: R0603_5K1_1%_0.1W_100PPM; Case: 0603; Mounted: Yes; Socket: No; SMD: Yes; Manufacturer1 Example: NIC COMPONENT; Manufacturer1 ComponentHeight: 0.55mm; HelpURL: \\cern.ch\dfs\Applications\Altium\Datasheets\R0603_NIC_NRC.pdf; Author: CERN DEM JLC; CreateDate: 12/3/2007; LatestRevisionDate: 3/13/2008
R237 = R0603_4K12_1%_0.1W_100PPM: Resistor - 1%; Part Description: General Purpose Thick Film Chip Resistor; Manufacturer: GENERIC; Manufacturer1 Part Number: RCW06034K12FKEA; Power: 0.1W; TC: ±100ppm/°C; Table: Resistors SMD; Part Number: R0603_4K12_1%_0.1W_100PPM; Component Kind: Standard; Component Type: Standard; Pin Count: 2; Value: 4k12; Status: Preferred; Tolerance: ±1%; Manufacturer Part Number: R0603_4K12_1%_0.1W_100PPM; Case: 0603; Mounted: Yes; Socket: No; SMD: Yes; Manufacturer1 Example: VISHAY; Manufacturer1 ComponentHeight: 0.55mm; HelpURL: \\cern.ch\dfs\Applications\Altium\Datasheets\R0603_VISHAY_CRCW e3.pdf; Author: CERN DEM JLC; CreateDate: 15/07/2010; LatestRevisionDate: 11/12/2013

## Sheet fmc_connector.SchDoc: Fine Delay FMC
size 297 x 209 mm; CheckedBy: B. Civel; Author: M.C., T.W., E.B.; CompanyName: CERN; DrawnBy: TW, GK; Engineer: TW; Organization: CERN; Address1: European Organization for Nuclear Research; Address2: CH-1211 Geneve 23 - SwitzerLA_Pd; DocumentNumber: 3; Revision: -; SheetNumber: 3; SheetTotal: 10; ModifiedBy: B. Civel; CreateDate: 10/07/2010; CheckedDate: 06/06/2013; Title2: FMC connector wiring; Designer: TW, GK; PageSetup: Record=PageOptions|CenterHorizontal=True|CenterVertical=True|PrintScale=0.96|XCorrection=1.00|YCorrection=1.00|PrintKind=1|BorderSize=5000000|LeftOffset=0|BottomOffset=0|Orientation=2|PaperLength=1000|PaperWidth=1000|Scale=100|PaperSource=15|PrintQuality=600|MediaType=1|DitherType=10|PaperKind=A3|PrintScaleMode=1; Projet: Fine Delay FMC (FMCDel1ns4cha); DivGrp: BE-CO; EDA_Number: EDA-02267-V6-0; ModifiedDate: 16/08/2012
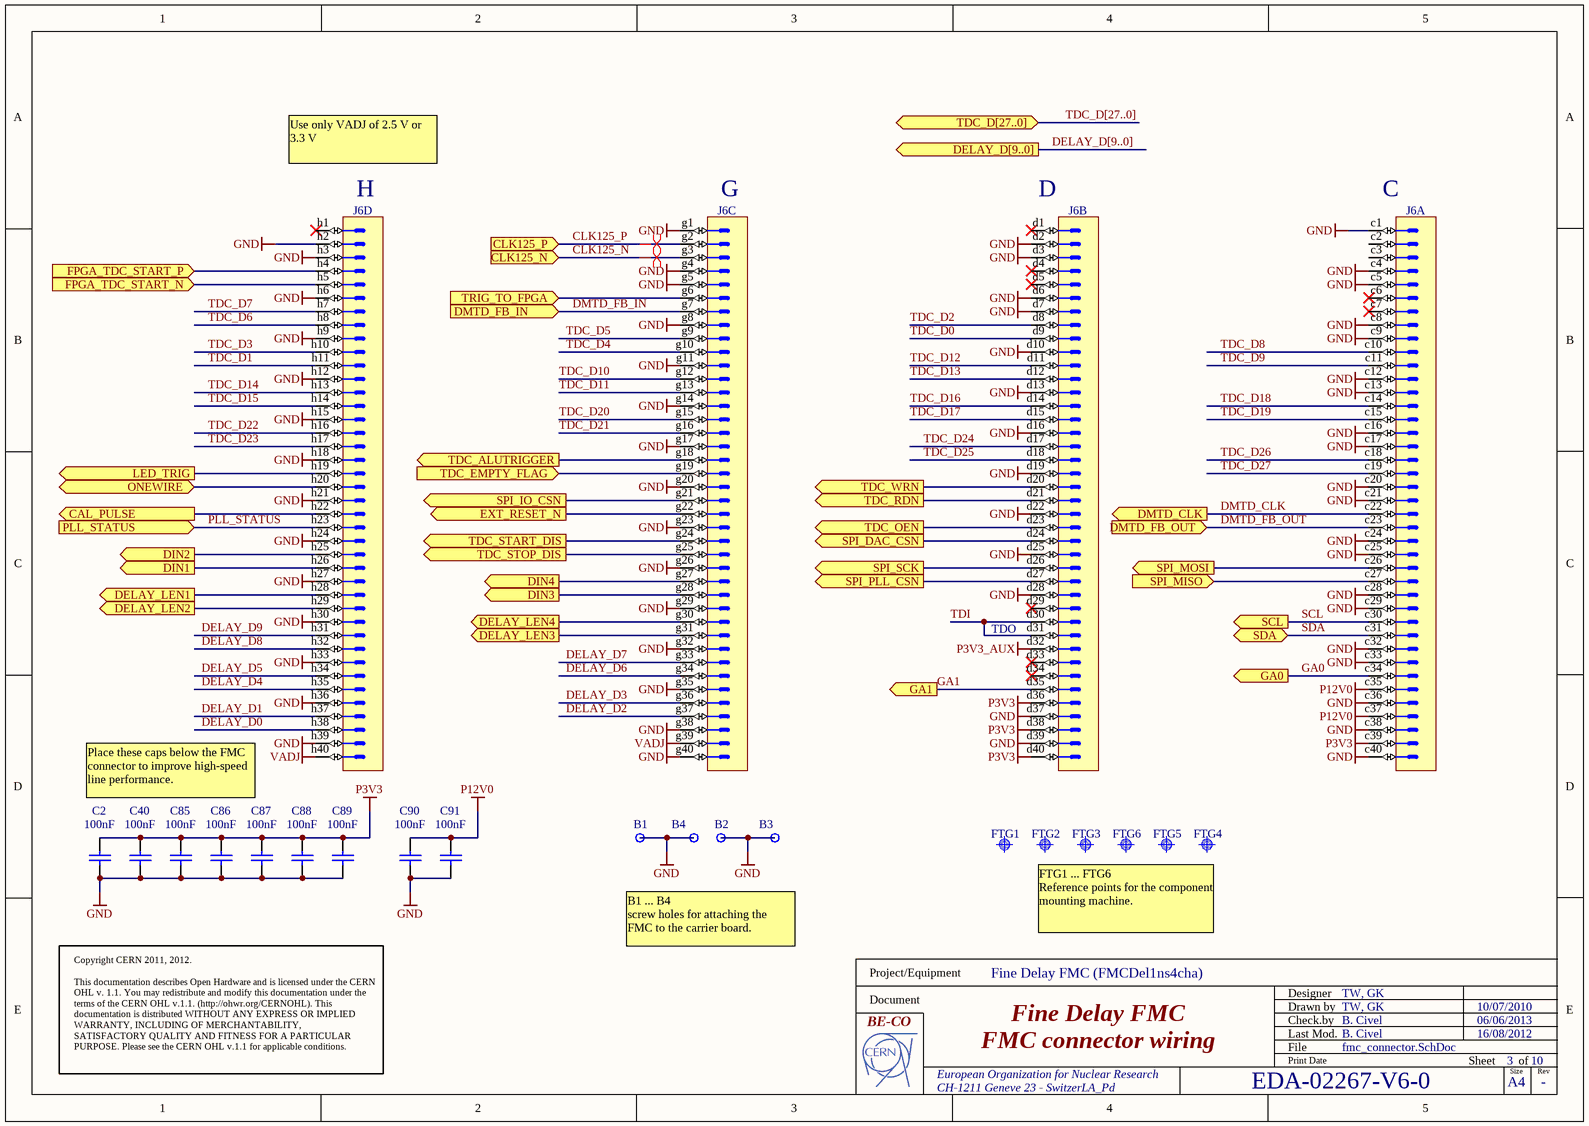
[diagram p2: fmc_connector.SchDoc]

### Parts
B1  Plated Hole  [MTG300_600]  (value not drawn)
B2  Plated Hole  [MTG300_600]  (value not drawn)
B3  Plated Hole  [MTG300_600]  (value not drawn)
B4  Plated Hole  [MTG300_600]  (value not drawn)
C2  100nF  [CAPC1608X87N]
C40  100nF  [CAPC1608X87N]
C85  100nF  [CAPC1608X87N]
C86  100nF  [CAPC1608X87N]
C87  100nF  [CAPC1608X87N]
C88  100nF  [CAPC1608X87N]
C89  100nF  [CAPC1608X87N]
C90  100nF  [CAPC1608X87N]
C91  100nF  [CAPC1608X87N]
FTG1  Use only in PCB  [FIDUCIAL_TOP_S100-200]  (value not drawn)
FTG2  Use only in PCB  [FIDUCIAL_TOP_S100-200]  (value not drawn)
FTG3  Use only in PCB  [FIDUCIAL_TOP_S100-200]  (value not drawn)
FTG4  Use only in PCB  [FIDUCIAL_TOP_S100-200]  (value not drawn)
FTG5  Use only in PCB  [FIDUCIAL_TOP_S100-200]  (value not drawn)
FTG6  Use only in PCB  [FIDUCIAL_TOP_S100-200]  (value not drawn)
J6  VITA 57  [SAMTEC_ASP-134604-01]  (value not drawn)  (parts A,B,C,D of 4)

### Ports
CAL_PULSE (out), CLK125_N (in), CLK125_P (in), DELAY_D[9..0] (out), DELAY_LEN1 (out), DELAY_LEN2 (out), DELAY_LEN3 (out), DELAY_LEN4 (out), DIN1 (out), DIN2 (out), DIN3 (out), DIN4 (out), DMTD_CLK (out), DMTD_FB_IN (in), DMTD_FB_OUT (in), EXT_RESET_N (out), FPGA_TDC_START_N (in), FPGA_TDC_START_P (in), GA0 (out), GA1 (out), LED_TRIG (out), ONEWIRE (bidir), PLL_STATUS (in), SCL (out), SDA (bidir), SPI_DAC_CSN (out), SPI_IO_CSN (out), SPI_MISO (in), SPI_MOSI (out), SPI_PLL_CSN (out), SPI_SCK (out), TDC_ALUTRIGGER (out), TDC_D[27..0] (bidir), TDC_EMPTY_FLAG (in), TDC_OEN (out), TDC_RDN (out), TDC_START_DIS (out), TDC_STOP_DIS (out), TDC_WRN (out), TRIG_TO_FPGA (in)

### Nets
GND: B1.1 B2.1 B3.1 B4.1 C2.1 C40.1 C85.1 C86.1 C87.1 C88.1 C89.1 C90.1 C91.1 J6.c1 J6.c4 J6.c5 J6.c8 J6.c9 J6.c12 J6.c13 J6.c16 J6.c17 J6.c20 J6.c21 J6.c24 J6.c25 J6.c28 J6.c29 J6.c32 J6.c33 J6.c36 J6.c38 J6.c40 J6.d2 J6.d3 J6.d6 J6.d7 J6.d10 J6.d13 J6.d16 J6.d19 J6.d22 J6.d25 J6.d28 J6.d37 J6.d39 J6.g1 J6.g4 J6.g5 J6.g8 J6.g11 J6.g14 J6.g17 J6.g20 J6.g23 J6.g26 J6.g29 J6.g32 J6.g35 J6.g38 J6.g40 J6.h2 J6.h3 J6.h6 J6.h9 J6.h12 J6.h15 J6.h18 J6.h21 J6.h24 J6.h27 J6.h30 J6.h33 J6.h36 J6.h39
P3V3: C2.2 C40.2 C85.2 C86.2 C87.2 C88.2 C89.2 J6.c39 J6.d36 J6.d38 J6.d40
P3V3_AUX: J6.d32
P12V0: C90.2 C91.2 J6.c35 J6.c37
VADJ: J6.g39 J6.h40
CLK125_N: J6.g3 ; port CLK125_N
CLK125_P: J6.g2 ; port CLK125_P
DELAY_D0: J6.h38
DELAY_D1: J6.h37
DELAY_D2: J6.g37
DELAY_D3: J6.g36
DELAY_D4: J6.h35
DELAY_D5: J6.h34
DELAY_D6: J6.g34
DELAY_D7: J6.g33
DELAY_D8: J6.h32
DELAY_D9: J6.h31
DELAY_LEN1: J6.h28 ; port DELAY_LEN1
DELAY_LEN2: J6.h29 ; port DELAY_LEN2
DELAY_LEN3: J6.g31 ; port DELAY_LEN3
DELAY_LEN4: J6.g30 ; port DELAY_LEN4
DIN1: J6.h26 ; port DIN1
DIN2: J6.h25 ; port DIN2
DIN3: J6.g28 ; port DIN3
DIN4: J6.g27 ; port DIN4
DMTD_CLK: J6.c22 ; port DMTD_CLK
DMTD_FB_IN: J6.g7 ; port DMTD_FB_IN
DMTD_FB_OUT: J6.c23 ; port DMTD_FB_OUT
EXT_RESET_N: J6.g22 ; port EXT_RESET_N
FPGA_TDC_START_N: J6.h5 ; port FPGA_TDC_START_N
FPGA_TDC_START_P: J6.h4 ; port FPGA_TDC_START_P
GA0: J6.c34 ; port GA0
GA1: J6.d35 ; port GA1
PLL_STATUS: J6.h23 ; port PLL_STATUS
SCL: J6.c30 ; port SCL
SDA: J6.c31 ; port SDA
SPI_DAC_CSN: J6.d24 ; port SPI_DAC_CSN
SPI_IO_CSN_2V5: J6.g21 ; port SPI_IO_CSN
SPI_MISO: J6.c27 ; port SPI_MISO
SPI_MOSI_2V5: J6.c26 ; port SPI_MOSI
SPI_PLL_CSN: J6.d27 ; port SPI_PLL_CSN
SPI_SCK_2V5: J6.d26 ; port SPI_SCK
TDC_D0: J6.d9
TDC_D1: J6.h11
TDC_D2: J6.d8
TDC_D3: J6.h10
TDC_D4: J6.g10
TDC_D5: J6.g9
TDC_D6: J6.h8
TDC_D7: J6.h7
TDC_D8: J6.c10
TDC_D9: J6.c11
TDC_D10: J6.g12
TDC_D11: J6.g13
TDC_D12: J6.d11
TDC_D13: J6.d12
TDC_D14: J6.h13
TDC_D15: J6.h14
TDC_D16: J6.d14
TDC_D17: J6.d15
TDC_D18: J6.c14
TDC_D19: J6.c15
TDC_D20: J6.g15
TDC_D21: J6.g16
TDC_D22: J6.h16
TDC_D23: J6.h17
TDC_D24: J6.d17
TDC_D25: J6.d18
TDC_D26: J6.c18
TDC_D27: J6.c19
TDC_OEN: J6.d23 ; port TDC_OEN
TDC_RDN: J6.d21 ; port TDC_RDN
TDC_WRN: J6.d20 ; port TDC_WRN
TDI: J6.d30 J6.d31
TRIG_TO_FPGA: J6.g6 ; port TRIG_TO_FPGA
NetIC8_4: J6.g24 ; port TDC_START_DIS
NetIC8_5: J6.g25 ; port TDC_STOP_DIS
NetIC13_1: J6.h20 ; port ONEWIRE
NetIC31_2: J6.h22 ; port CAL_PULSE
NetJ6_g18: J6.g18 ; port TDC_ALUTRIGGER
NetJ6_g19: J6.g19 ; port TDC_EMPTY_FLAG
NetJ6_h19: J6.h19 ; port LED_TRIG

Not connected (* = marked no-connect by the designer): J6 c2 c3 c6* c7* d1* d4* d5* d29* d33* d34* h1*

### Buses and harness runs
bus DELAY_D[9..0] = port DELAY_D[9..0]
bus TDC_D[27..0] = port TDC_D[27..0]

### Layout directives
differential pair: CLK125_N, CLK125_P

### Notes on the sheet
- Use only VADJ of 2.5 V or 3.3 V
- (near J6) H
- (near J6) G
- (near J6) D
- (near J6) C
- (near J6) TDO
- Place these caps below the FMC connector to improve high-speed line performance.
- B1 ... B4
  screw holes for attaching the FMC to the carrier board.
- FTG1 ... FTG6
  Reference points for the component mounting machine.
- Copyright CERN 2011, 2012.
  This documentation describes Open Hardware and is licensed under the CERN OHL v. 1.1. You may redistribute and modify this documentation under the terms of the CERN OHL v.1.1. (http://ohwr.org/CERNOHL). This documentation is distributed WITHOUT ANY EXPRESS OR IMPLIED WARRANTY, INCLUDING OF MERCHANTABILITY, SATISFACTORY QUALITY AND FITNESS FOR A PARTICULAR PURPOSE. Please see the CERN OHL v.1.1 for applicable conditions.
- Project/Equipment
- Document
- Designer
- Drawn by
- Check.by
- File
- Last Mod.
- Print Date
- Sheet
- Size
- A4
- of
- Rev

### Library data of the parts
B1-B4 = PLATED_HOLE3.0_PAD6.0: Single Terminal Socket; Part Description: Plated Through Hole: Hole Dia.=3.0mm Pad Dia.=6.0mm; Mounted: No; Table: Pads; Part Number: PLATED_HOLE3.0_PAD6.0; Component Kind: Standard (No BOM); Component Type: Standard (No BOM); Designator: Single Terminal Socket; Library Reference: Single Terminal Socket; Pin Count: 1; Family: Plated Hole; Socket: No; SMD: No; Status: None; ComponentHeight: 0mm; Author: CERN DEM JLC; CreateDate: 5/26/2008; LatestRevisionDate: 5/26/2008; PackageDescription: Plated Through Hole: Hole Dia.=3.0mm Pad Dia.=6.0mm
C2 C40 C85-C91 = CC0603_100NF_50V_10%_X7R: as C12 on sheet clock_generator; Part Number: CC0603_100NF_50V_10%_X7R; Component Kind: Standard; Component Type: Standard; Pin Count: 2; Value: 100nF; Status: Preferred; Manufacturer Part Number: CC0603_100NF_50V_10%_X7R; Case: 0603; Mounted: Yes; Socket: No; SMD: Yes; Manufacturer1 Example: PHYCOMP; Manufacturer1 ComponentHeight: 0.87mm; HelpURL: \\cern.ch\dfs\Applications\Altium\Datasheets\CC0603_X7R_PHYCOMP.pdf; Author: CERN DEM JLC; CreateDate: 12/3/2007; LatestRevisionDate: 12/3/2007
FTG1-FTG6 = FIDUCIAL_TARGET_S100-200: Fiducial Target; Part Description: Square Fiducial Target, Top Layer, 1.0mm, Top Solder 2.0mm, Keepout =2.0mm; Mounted: No; Table: Pads; Part Number: FIDUCIAL_TARGET_S100-200; Component Kind: Standard (No BOM); Component Type: Standard (No BOM); Pin Count: 1; Family: Fiducial; Socket: No; SMD: Yes; Status: None; ComponentHeight: 0mm; Author: CERN DEM JLC; CreateDate: 09/02/2010; LatestRevisionDate: 04/04/2012; PackageDescription: Square Fiducial Target, Top Layer, 1.0mm, Top Solder 2.0mm, Keepout =2.0mm
J6 = SAMTEC_ASP-134604-01: Connector VITA 57, 160 Male contacts in 4 row cdgh; Part Description: 160 contacts (4 rows cdgh) Surface Mount Male Connector, VITA 57 (MC-LPC-10); Manufacturer: SAMTEC; Part Number: SAMTEC_ASP-134604-01; Component Kind: Standard; Component Type: Standard; Pin Count: 160; Family: VITA 57; Mounted: Yes; Socket: No; SMD: Yes; Status: None; Manufacturer Part Number: ASP-134604-01; ComponentHeight: 6.1mm; HelpURL: \\cern.ch\dfs\Applications\Altium\Datasheets\SAMTEC_ASP-134604-01.pdf; Author: CERN DEM JLC; CreateDate: 8/31/2011; LatestRevisionDate: 8/31/2011; Table: SAMTEC